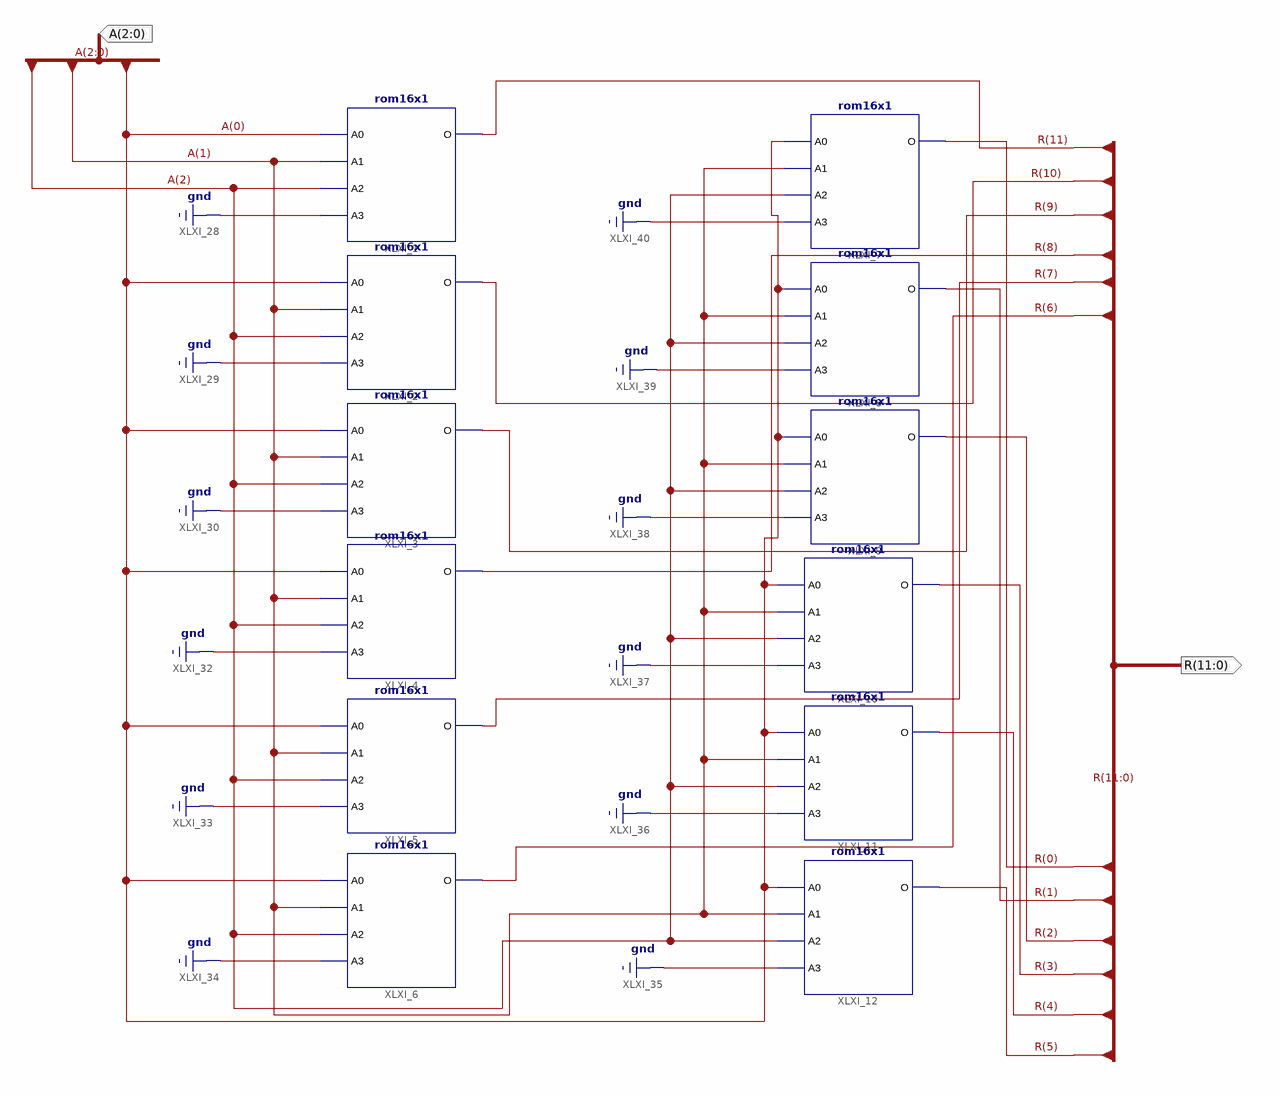
[diagram p0: schematic sheet 1]
// Xilinx ISE schematic ProgramRom.sch (spartan3e) as structural Verilog: 12 symbols, 2 ports
module ProgramRom (
  input  [2:0] A,
  output [11:0] R
);

  rom16x1 #(.INIT("0063")) XLXI_1 (.A0(A[0]), .A1(A[1]), .A2(A[2]), .A3(1'b0), .O(R[11]));
  rom16x1 #(.INIT("0064")) XLXI_2 (.A0(A[0]), .A1(A[1]), .A2(A[2]), .A3(1'b0), .O(R[10]));
  rom16x1 XLXI_3 (.A0(A[0]), .A1(A[1]), .A2(A[2]), .A3(1'b0), .O(R[9]));
  rom16x1 #(.INIT("002F")) XLXI_4 (.A0(A[0]), .A1(A[1]), .A2(A[2]), .A3(1'b0), .O(R[8]));
  rom16x1 #(.INIT("0016")) XLXI_5 (.A0(A[0]), .A1(A[1]), .A2(A[2]), .A3(1'b0), .O(R[7]));
  rom16x1 XLXI_6 (.A0(A[0]), .A1(A[1]), .A2(A[2]), .A3(1'b0), .O(R[6]));
  rom16x1 #(.INIT("0062")) XLXI_7 (.A0(A[0]), .A1(A[1]), .A2(A[2]), .A3(1'b0), .O(R[0]));
  rom16x1 #(.INIT("0040")) XLXI_8 (.A0(A[0]), .A1(A[1]), .A2(A[2]), .A3(1'b0), .O(R[1]));
  rom16x1 #(.INIT("0021")) XLXI_9 (.A0(A[0]), .A1(A[1]), .A2(A[2]), .A3(1'b0), .O(R[2]));
  rom16x1 #(.INIT("0000")) XLXI_10 (.A0(A[0]), .A1(A[1]), .A2(A[2]), .A3(1'b0), .O(R[3]));
  rom16x1 #(.INIT("0008")) XLXI_11 (.A0(A[0]), .A1(A[1]), .A2(A[2]), .A3(1'b0), .O(R[4]));
  rom16x1 #(.INIT("0018")) XLXI_12 (.A0(A[0]), .A1(A[1]), .A2(A[2]), .A3(1'b0), .O(R[5]));
endmodule
